# EAGLE schematic PPU_MINI (EAGLE 9.6.2)
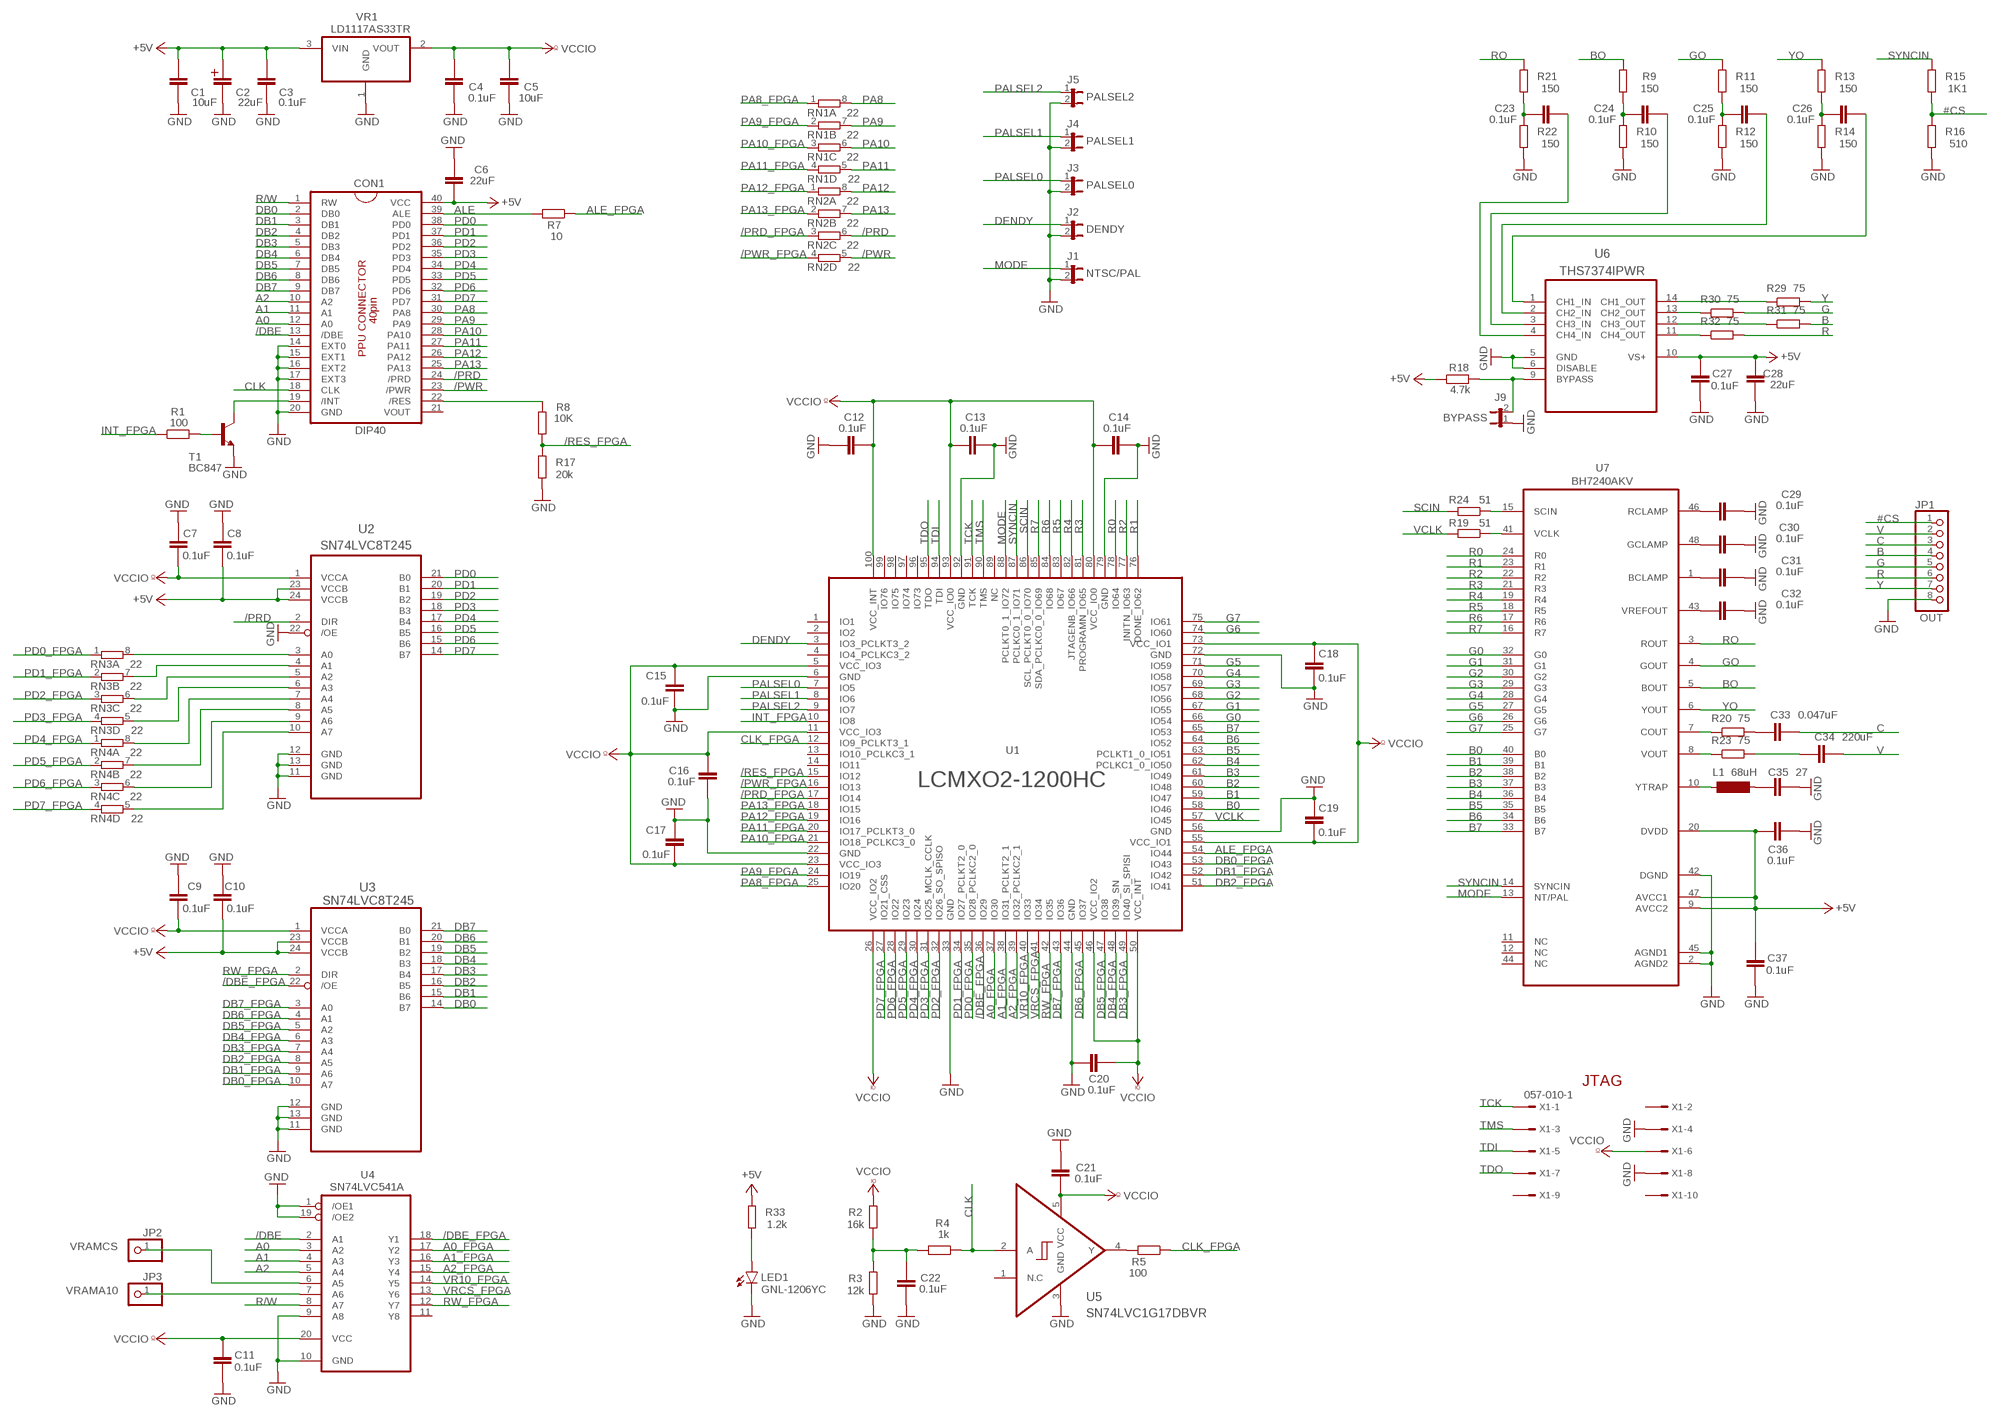
[diagram p0: schematic, sheet 1]

## Parts
C1  10uF  C-EUC0603  [C0603]
C2  22uF  CPOL-EU150CLZ-1014  [150CLZ-1014]
C3  0.1uF  C-EUC0603  [C0603]
C4  0.1uF  C-EUC0603  [C0603]
C5  10uF  C-EUC0603  [C0603]
C6  22uF  C-EUC0603  [C0603]
C7  0.1uF  C-EUC0603  [C0603]
C8  0.1uF  C-EUC0603  [C0603]
C9  0.1uF  C-EUC0603  [C0603]
C10  0.1uF  C-EUC0603  [C0603]
C11  0.1uF  C-EUC0603  [C0603]
C12  0.1uF  C-EUC0603  [C0603]
C13  0.1uF  C-EUC0603  [C0603]
C14  0.1uF  C-EUC0603  [C0603]
C15  0.1uF  C-EUC0603  [C0603]
C16  0.1uF  C-EUC0603  [C0603]
C17  0.1uF  C-EUC0603  [C0603]
C18  0.1uF  C-EUC0603  [C0603]
C19  0.1uF  C-EUC0603  [C0603]
C20  0.1uF  C-EUC0603  [C0603]
C21  0.1uF  C-EUC0603  [C0603]
C22  0.1uF  C-EUC0603  [C0603]
C23  0.1uF  C-EUC0603  [C0603]
C24  0.1uF  C-EUC0603  [C0603]
C25  0.1uF  C-EUC0603  [C0603]
C26  0.1uF  C-EUC0603  [C0603]
C27  0.1uF  C-EUC0603  [C0603]
C28  22uF  C-EUC0603  [C0603]
C29  0.1uF  C-EUC0603  [C0603]
C30  0.1uF  C-EUC0603  [C0603]
C31  0.1uF  C-EUC0603  [C0603]
C32  0.1uF  C-EUC0603  [C0603]
C33  0.047uF  C-EUC0603  [C0603]
C34  220uF  C-EUC0603  [C0603]
C35  27  C-EUC0603  [C0603]
C36  0.1uF  C-EUC0603  [C0603]
C37  0.1uF  C-EUC0603  [C0603]
CON1  DIP40  [DIP-40]
J1  NTSC/PAL  JP1E  [JP1]
J2  DENDY  JP1E  [JP1]
J3  PALSEL0  JP1E  [JP1]
J4  PALSEL1  JP1E  [JP1]
J5  PALSEL2  JP1E  [JP1]
J9  BYPASS  JP1E  [JP1]
JP1  OUT  PINHD-1X8  [1X08]
JP2  VRAMCS  PINHD-1X1  [1X01]
JP3  VRAMA10  PINHD-1X1  [1X01]
L1  68uH  SM-NE29  [SM-NE29]
LED1  GNL-1206YC  LEDSML1206  [SML1206]
R1  100  R-EU_R0805  [R0805]
R2  16k  R-EU_R0805  [R0805]
R3  12k  R-EU_R0805  [R0805]
R4  1k  R-EU_R0805  [R0805]
R5  100  R-EU_R0805  [R0805]
R7  10  R-EU_R0805  [R0805]
R8  10K  R-EU_R0805  [R0805]
R9  150  R-EU_R0805  [R0805]
R10  150  R-EU_R0805  [R0805]
R11  150  R-EU_R0805  [R0805]
R12  150  R-EU_R0805  [R0805]
R13  150  R-EU_R0805  [R0805]
R14  150  R-EU_R0805  [R0805]
R15  1K1  R-EU_R0805  [R0805]
R16  510  R-EU_R0805  [R0805]
R17  20k  R-EU_R0805  [R0805]
R18  4.7k  R-EU_R0805  [R0805]
R19  51  R-EU_R0805  [R0805]
R20  75  R-EU_R0805  [R0805]
R21  150  R-EU_R0805  [R0805]
R22  150  R-EU_R0805  [R0805]
R23  75  R-EU_R0805  [R0805]
R24  51  R-EU_R0805  [R0805]
R29  75  R-EU_R0805  [R0805]
R30  75  R-EU_R0805  [R0805]
R31  75  R-EU_R0805  [R0805]
R32  75  R-EU_R0805  [R0805]
R33  1.2k  R-EU_R0805  [R0805]
RN1  22  4R-N0603-ARC  [0603-ARC]
RN2  22  4R-N0603-ARC  [0603-ARC]
RN3  22  4R-N0603-ARC  [0603-ARC]
RN4  22  4R-N0603-ARC  [0603-ARC]
T1  BC847  [SOT23]
U1  LCMXO2-1200HC  [QFP50P1600X1600X120-100N]
U2  SN74LVC8T245  [SOP65P640X110-24N]
U3  SN74LVC8T245  [SOP65P640X110-24N]
U4  SN74LVC541A  [TSOP20]
U5  SN74LVC1G17DBVR  [SOT95P280X145-5N]
U6  THS7374IPWR  [SOP65P640X120-14N]
U7  BH7240AKV  [QFP50P900X900X160-48N]
VR1  LD1117AS33TR  [SOT230P700X180-4N]
X1  057-010-1  [057-010-1]

## Nets
#CS: JP1.1 R15.1 R16.2
+5V: C1.2 C2.+ C3.2 C6.1 C8.1 C10.1 C27.2 C28.2 C36.2 C37.2 CON1.40(VCC) R18.1 R33.2 U2.23(VCCB) U2.24(VCCB) U3.23(VCCB) U3.24(VCCB) U6.10(VS+) U7.9(AVCC2) U7.20(DVDD) U7.47(AVCC1) VR1.3(VIN)
/DBE: CON1.13(/DBE) U4.2(A1)
/DBE_FPGA: U1.36(IO29) U3.22(/OE) U4.18(Y1)
/PRD: CON1.24(/PRD) RN2.6 U2.2(DIR)
/PRD_FPGA: RN2.3 U1.17(IO14)
/PWR: CON1.23(/PWR) RN2.5
/PWR_FPGA: RN2.4 U1.16(IO13)
/RES_FPGA: R8.1 R17.2 U1.15(IO12)
A0: CON1.12(A0) U4.3(A2)
A0_FPGA: U1.37(IO30) U4.17(Y2)
A1: CON1.11(A1) U4.4(A3)
A1_FPGA: U1.38(IO31_PCLKT2_1) U4.16(Y3)
A2: CON1.10(A2) U4.5(A4)
A2_FPGA: U1.39(IO32_PCLKC2_1) U4.15(Y4)
ALE: CON1.39(ALE) R7.2
ALE_FPGA: R7.1 U1.54(IO44)
B: JP1.4 R31.2
B0: U1.58(IO46) U7.40(B0)
B1: U1.59(IO47) U7.39(B1)
B2: U1.60(IO48) U7.38(B2)
B3: U1.61(IO49) U7.37(B3)
B4: U1.62(PCLKC1_0_IO50) U7.36(B4)
B5: U1.63(PCLKT1_0_IO51) U7.35(B5)
B6: U1.64(IO52) U7.34(B6)
B7: U1.65(IO53) U7.33(B7)
BO: R9.2 U7.5(BOUT)
C: C33.1 JP1.3
CLK: CON1.18(CLK) R4.1 U5.2(A)
CLK_FPGA: R5.1 U1.12(IO9_PCLKT3_1)
DB0: CON1.2(DB0) U3.14(B7)
DB0_FPGA: U1.53(IO43) U3.10(A7)
DB1: CON1.3(DB1) U3.15(B6)
DB1_FPGA: U1.52(IO42) U3.9(A6)
DB2: CON1.4(DB2) U3.16(B5)
DB2_FPGA: U1.51(IO41) U3.8(A5)
DB3: CON1.5(DB3) U3.17(B4)
DB3_FPGA: U1.49(IO40_SI_SPISI) U3.7(A4)
DB4: CON1.6(DB4) U3.18(B3)
DB4_FPGA: U1.48(IO39_SN) U3.6(A3)
DB5: CON1.7(DB5) U3.19(B2)
DB5_FPGA: U1.47(IO38) U3.5(A2)
DB6: CON1.8(DB6) U3.20(B1)
DB6_FPGA: U1.45(IO37) U3.4(A1)
DB7: CON1.9(DB7) U3.21(B0)
DB7_FPGA: U1.43(IO36) U3.3(A0)
DENDY: J2.1 U1.3(IO3_PCLKT3_2)
G: JP1.5 R30.2
G0: U1.66(IO54) U7.32(G0)
G1: U1.67(IO55) U7.31(G1)
G2: U1.68(IO56) U7.30(G2)
G3: U1.69(IO57) U7.29(G3)
G4: U1.70(IO58) U7.28(G4)
G5: U1.71(IO59) U7.27(G5)
G6: U1.74(IO60) U7.26(G6)
G7: U1.75(IO61) U7.25(G7)
GND: C1.1 C2.- C3.1 C4.1 C5.1 C6.2 C7.2 C8.2 C9.2 C10.2 C11.1 C12.2 C13.1 C14.1 C15.1 C16.1 C17.2 C18.1 C19.2 C20.2 C21.2 C22.1 C27.1 C28.1 C29.1 C30.1 C31.1 C32.1 C35.1 C36.1 C37.1 CON1.14(EXT0) CON1.15(EXT1) CON1.16(EXT2) CON1.17(EXT3) CON1.20(GND) J1.2 J2.2 J3.2 J4.2 J5.2 J9.1 JP1.8 LED1.C R3.1 R10.1 R12.1 R14.1 R16.1 R17.1 R22.1 T1.2(E) U1.6(GND) U1.22(GND) U1.33(GND) U1.44(GND) U1.56(GND) U1.72(GND) U1.79(GND) U1.92(GND) U2.11(GND) U2.12(GND) U2.13(GND) U2.22(/OE) U3.11(GND) U3.12(GND) U3.13(GND) U4.1(/OE1) U4.9(A8) U4.10(GND) U4.19(/OE2) U5.3(GND) U6.5(GND) U6.6(DISABLE) U7.2(AGND2) U7.42(DGND) U7.45(AGND1) VR1.1(GND) X1.4 X1.8
GO: R11.2 U7.4(GOUT)
INT_FPGA: R1.1 U1.10(IO8)
MODE: J1.1 U1.88(PCLKT0_1_IO72) U7.13(NT/PAL)
N$1: LED1.A R33.1
N$2: R5.2 U5.4(Y)
N$3: JP2.1 U4.6(A5)
N$4: CON1.19(/INT) T1.3(C)
N$5: R1.2 T1.1(B)
N$6: R19.1 U7.41(VCLK)
N$7: CON1.22(/RES) R8.2
N$8: RN3.8 U2.3(A0)
N$9: RN3.7 U2.4(A1)
N$10: C29.2 U7.46(RCLAMP)
N$11: C30.2 U7.48(GCLAMP)
N$12: C31.2 U7.1(BCLAMP)
N$13: C32.2 U7.43(VREFOUT)
N$14: C24.2 R9.1 R10.2
N$15: J9.2 R18.2 U6.9(BYPASS)
N$16: C25.2 R11.1 R12.2
N$17: C23.1 U6.4(CH4_IN)
N$18: C24.1 U6.3(CH3_IN)
N$19: C25.1 U6.2(CH2_IN)
N$20: C26.2 R13.1 R14.2
N$21: C26.1 U6.1(CH1_IN)
N$22: RN3.6 U2.5(A2)
N$23: RN3.5 U2.6(A3)
N$24: JP3.1 U4.7(A6)
N$25: RN4.8 U2.7(A4)
N$26: RN4.7 U2.8(A5)
N$27: RN4.6 U2.9(A6)
N$28: RN4.5 U2.10(A7)
N$29: L1.1 U7.10(YTRAP)
N$30: C35.2 L1.2
N$31: R20.1 U7.7(COUT)
N$32: R23.1 U7.8(VOUT)
N$33: C33.2 R20.2
N$34: C34.2 R23.2
N$37: R24.1 U7.15(SCIN)
N$40: C22.2 R2.1 R3.2 R4.2
N$42: C23.2 R21.1 R22.2
N$64: R29.1 U6.14(CH1_OUT)
N$65: R30.1 U6.13(CH2_OUT)
N$66: R31.1 U6.12(CH3_OUT)
N$67: R32.1 U6.11(CH4_OUT)
PA8: CON1.30(PA8) RN1.8
PA8_FPGA: RN1.1 U1.25(IO20)
PA9: CON1.29(PA9) RN1.7
PA9_FPGA: RN1.2 U1.24(IO19)
PA10: CON1.28(PA10) RN1.6
PA10_FPGA: RN1.3 U1.21(IO18_PCLKC3_0)
PA11: CON1.27(PA11) RN1.5
PA11_FPGA: RN1.4 U1.20(IO17_PCLKT3_0)
PA12: CON1.26(PA12) RN2.8
PA12_FPGA: RN2.1 U1.19(IO16)
PA13: CON1.25(PA13) RN2.7
PA13_FPGA: RN2.2 U1.18(IO15)
PALSEL0: J3.1 U1.7(IO5)
PALSEL1: J4.1 U1.8(IO6)
PALSEL2: J5.1 U1.9(IO7)
PD0: CON1.38(PD0) U2.21(B0)
PD0_FPGA: RN3.1 U1.35(IO28_PCLKC2_0)
PD1: CON1.37(PD1) U2.20(B1)
PD1_FPGA: RN3.2 U1.34(IO27_PCLKT2_0)
PD2: CON1.36(PD2) U2.19(B2)
PD2_FPGA: RN3.3 U1.32(IO26_SO_SPISO)
PD3: CON1.35(PD3) U2.18(B3)
PD3_FPGA: RN3.4 U1.31(IO25_MCLK_CCLK)
PD4: CON1.34(PD4) U2.17(B4)
PD4_FPGA: RN4.1 U1.30(IO24)
PD5: CON1.33(PD5) U2.16(B5)
PD5_FPGA: RN4.2 U1.29(IO23)
PD6: CON1.32(PD6) U2.15(B6)
PD6_FPGA: RN4.3 U1.28(IO22)
PD7: CON1.31(PD7) U2.14(B7)
PD7_FPGA: RN4.4 U1.27(IO21_CSS)
R: JP1.6 R32.2
R0: U1.78(IO64) U7.24(R0)
R1: U1.76(DONE_IO62) U7.23(R1)
R2: U1.77(INITN_IO63) U7.22(R2)
R3: U1.81(PROGRAMN_IO65) U7.21(R3)
R4: U1.82(JTAGENB_IO66) U7.19(R4)
R5: U1.83(IO67) U7.18(R5)
R6: U1.84(IO68) U7.17(R6)
R7: U1.85(SDA_PCLKC0_0_IO69) U7.16(R7)
R/W: CON1.1(RW) U4.8(A7)
RO: R21.2 U7.3(ROUT)
RW_FPGA: U1.42(IO35) U3.2(DIR) U4.12(Y7)
SCIN: R24.2 U1.86(SCL_PCLKT0_0_IO70)
SYNCIN: R15.2 U1.87(PCLKC0_1_IO71) U7.14(SYNCIN)
TCK: U1.91(TCK) X1.1
TDI: U1.94(TDI) X1.5
TDO: U1.95(TDO) X1.7
TMS: U1.90(TMS) X1.3
V: C34.1 JP1.2
VCCIO: C4.2 C5.2 C7.1 C9.1 C11.2 C12.1 C13.2 C14.2 C15.2 C16.2 C17.1 C18.2 C19.1 C20.1 C21.1 R2.2 U1.5(VCC_IO3) U1.11(VCC_IO3) U1.23(VCC_IO3) U1.26(VCC_IO2) U1.46(VCC_IO2) U1.50(VCC_INT) U1.55(VCC_IO1) U1.73(VCC_IO1) U1.80(VCC_IO0) U1.93(VCC_IO0) U1.100(VCC_INT) U2.1(VCCA) U3.1(VCCA) U4.20(VCC) U5.5(VCC) VR1.2(VOUT) X1.6
VCLK: R19.2 U1.57(IO45)
VR10_FPGA: U1.40(IO33) U4.14(Y5)
VRCS_FPGA: U1.41(IO34) U4.13(Y6)
Y: JP1.7 R29.2
YO: R13.2 U7.6(YOUT)
Unconnected: CON1.21(VOUT) U1.1(IO1) U1.2(IO2) U1.4(IO4_PCLKC3_2) U1.13(IO10_PCLKC3_1) U1.14(IO11) U1.89(NC) U1.96(IO73) U1.97(IO74) U1.98(IO75) U1.99(IO76) U4.11(Y8) U5.1(N.C) U7.11(NC) U7.12(NC) U7.44(NC) X1.2 X1.9 X1.10

## Notes on the sheet
- JTAG

## Library data of the parts
C1 C3-C37 = rcl_my:C-EU: CAPACITOR, European symbol; SPICEPREFIX: C
C2 = rcl_my:CPOL-EU: POLARIZED CAPACITOR, European symbol; SPICEPREFIX: C
CON1 = SnapEDA-Library:DIP40
J1-J5 J9 = jumper:JP1E: JUMPER
JP1 = pinhead:PINHD-1X8: PIN HEADER
JP2 JP3 = pinhead:PINHD-1X1: PIN HEADER
L1 = inductor-neosid:SM-NE29: INDUCTOR SMD chip inductor; OC_FARNELL: unknown; OC_NEWARK: unknown
LED1 = led:LED: LED OSRAM: - CHIPLED LG R971, LG N971, LY N971, LG Q971, LY Q971, LO R971, LY R971 LH N974, LH R974 LS Q976, LO Q976, LY Q976 LO Q996 - Hyper CHIPLED LW Q18S LB Q993, LB Q99A, LB R99A - SideLED LS A670, LO A670, LY A670, LG A670, LP A670 LB A673, LV A673, LT A673, LW A673 LH A674 LY A675 LS A676, LA A676, LO A676, LY A676, LW A676 LS A679, LY A679, LG A679 - Hyper Micro SIDELED® LS Y876, LA Y876, LO Y876, LY Y876 LT Y87S - SmartLED LW L88C, LW L88S LB L89C, LB L89S, LG L890 LS L89K, LO L89K, LY L89K LS L896, LA L896, LO L896, LY L896 - TOPLED LS T670, LO T670, LY T670, LG T670, LP T670 LSG T670, LSP T670, LSY T670, LOP T670, LYG T670 LG T671, LOG T671, LSG T671 LB T673, LV T673, LT T673, LW T673 LH T674 LS T676, LA T676, LO T676, LY T676, LB T676, LH T676, LSB T676, LW T676 LB T67C, LV T67C, LT T67C, LS T67K, LO T67K, LY T67K, LW E67C LS E67B, LA E67B, LO E67B, LY E67B, LB E67C, LV E67C, LT E67C LW T67C LS T679, LY T679, LG T679 LS T770, LO T770, LY T770, LG T770, LP T770 LB T773, LV T773, LT T773, LW T773 LH T774 LS E675, LA E675, LY E675, LS T675 LS T776, LA T776, LO T776, LY T776, LB T776 LHGB T686 LT T68C, LB T68C - Hyper Mini TOPLED® LB M676 - Mini TOPLED Santana® LG M470 LS M47K, LO M47K, LY M47K Source: http://www.osram.convergy.de LUXEON: - LUMILED® LXK2-PW12-R00, LXK2-PW12-S00, LXK2-PW14-U00, LXK2-PW14-V00 LXK2-PM12-R00, LXK2-PM12-S00, LXK2-PM14-U00 LXK2-PE12-Q00, LXK2-PE12-R00, LXK2-PE12-S00, LXK2-PE14-T00, LXK2-PE14-U00 LXK2-PB12-K00, LXK2-PB12-L00, LXK2-PB12-M00, LXK2-PB14-N00, LXK2-PB14-P00, LXK2-PB14-Q00 LXK2-PR12-L00, LXK2-PR12-M00, LXK2-PR14-Q00, LXK2-PR14-R00 LXK2-PD12-Q00, LXK2-PD12-R00, LXK2-PD12-S00 LXK2-PH12-R00, LXK2-PH12-S00 LXK2-PL12-P00, LXK2-PL12-Q00, LXK2-PL12-R00 Source: www.luxeon.com KINGBRIGHT: KA-3528ASYC Source: www.kingbright.com
R1-R5 R7-R24 R29-R33 = rcl:R-EU_: RESISTOR, European symbol; SPICEPREFIX: R
RN1-RN4 = resistor-dil:4R-N: Array Chip Resistor Source: RS Component / Phycomp; OC_FARNELL: unknown; OC_NEWARK: unknown
T1 = transistor:BC847: NPN TRANSISTOR
U1 = LCMXO2-1200HC:LCMXO2-1200HC
U2 U3 = SnapEDA-Library:SN74LVC8T245
U4 = SnapEDA-Library:SN74LVC541A; PACKAGE: TSSOP-20; SUPPLIER: TI
U5 = SN74LVC1G17DBVR:SN74LVC1G17DBVR
U6 = THS7374IPWR:THS7374IPWR
U7 = BH7240AKV:BH7240AKV
VR1 = LD1117AS33TR:LD1117AS33TR
X1 = con-panduit:057-010-: CONNECTOR 10-pin series 057 contact pc board low profile headers; OC_FARNELL: unknown; OC_NEWARK: unknown